# EAGLE design 0-30V Stabilized PSU Mk.10 (EAGLE 6.4)
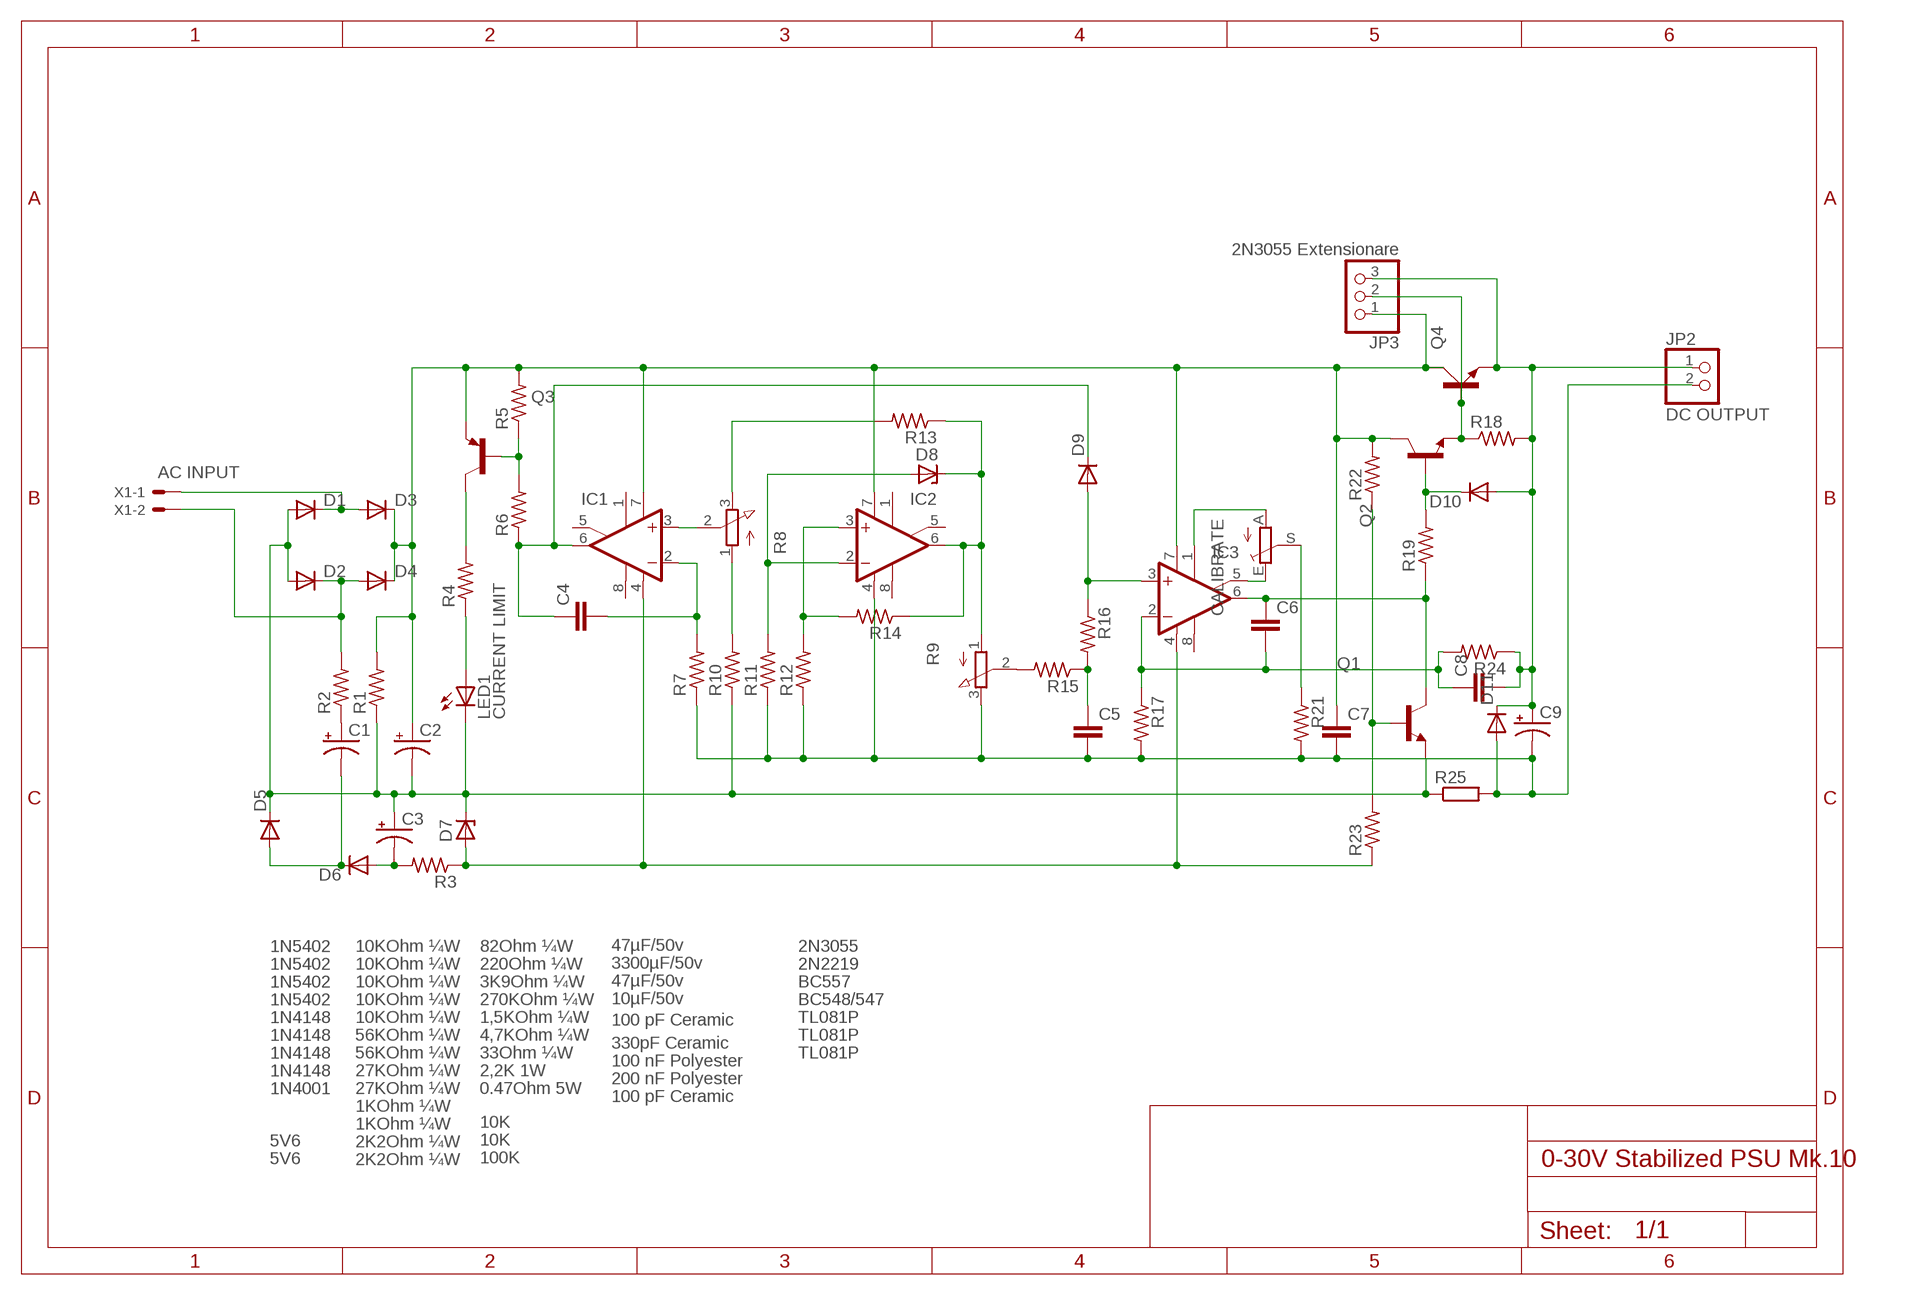
[diagram p0: schematic, sheet 1]

## Parts
C1  47µF/50v  CPOL-USTT2D4  [TT2D4]
C2  3300µF/50v  CPOL-USE10-20  [EB20D]
C3  47µF/50v  CPOL-USTT2D4  [TT2D4]
C4  330pF Ceramic  C-EU025-024X044  [C025-024X044]
C5  100 nF Polyester  C-EU050-025X075  [C050-025X075]
C6  100 pF Ceramic  C-EU050-024X044  [C050-024X044]
C7  200 nF Polyester  C-EU075-032X103  [C075-032X103]
C8  100 pF Ceramic  C-EU050-024X044  [C050-024X044]
C9  10µF/50v  CPOL-USE5-4  [E5-4]
CALIBRATE  100K  TRIM_EU-CA6V  [CA6V]
D1  1N5402  1N5400  [DO201-15]
D2  1N5402  1N5400  [DO201-15]
D3  1N5402  1N5400  [DO201-15]
D4  1N5402  1N5400  [DO201-15]
D5  1N4148  1N4148DO35-10  [DO35-10]
D6  1N4148  1N4148DO35-10  [DO35-10]
D7  5V6  ZENER-DIODEDO34-7  [DO34Z7]
D8  5V6  ZENER-DIODEDO34-7  [DO34Z7]
D9  1N4148  1N4148DO35-7  [DO35-7]
D10  1N4148  1N4148DO35-7  [DO35-7]
D11  1N4001  1N4148DO35-7  [DO35-7]
IC1  TL081P  [DIL08]
IC2  TL081P  [DIL08]
IC3  TL081P  [DIL08]
JP2  DC OUTPUT  PINHD-1X2  [1X02]
JP3  2N3055 Extensionare  PINHD-1X3  [1X03]
LED1  CURRENT LIMIT  LED3MM  [LED3MM]
Q1  BC548/547  BC548  [TO92-EBC]
Q2  2N2219  [TO5]
Q3  BC557  [TO92-EBC]
Q4  2N3055  [TO3A]
R1  2,2K 1W  R-US_0613/15  [P0613/15]
R2  82Ohm ¼W  R-US_0204/7  [0204/7]
R3  220Ohm ¼W  R-US_0204/7  [0204/7]
R4  3K9Ohm ¼W  R-US_0204/7  [0204/7]
R5  2K2Ohm ¼W  R-US_0204/7  [0204/7]
R6  10KOhm ¼W  R-US_0204/7  [0204/7]
R7  10KOhm ¼W  R-US_0204/7  [0204/7]
R8  10K  3RP/1610N  [3RP/1610N]
R9  10K  3RP/1610N  [3RP/1610N]
R10  33Ohm ¼W  R-US_0204/7  [0204/7]
R11  4,7KOhm ¼W  R-US_0204/7  [0204/7]
R12  10KOhm ¼W  R-US_0204/7  [0204/7]
R13  56KOhm ¼W  R-US_0204/7  [0204/7]
R14  10KOhm ¼W  R-US_0204/7  [0204/7]
R15  27KOhm ¼W  R-US_0204/7  [0204/7]
R16  2K2Ohm ¼W  R-US_0204/7  [0204/7]
R17  27KOhm ¼W  R-US_0204/7  [0204/7]
R18  1KOhm ¼W  R-US_0207/2V  [0207/2V]
R19  1KOhm ¼W  R-US_0207/2V  [0207/2V]
R21  270KOhm ¼W  R-US_0204/7  [0204/7]
R22  10KOhm ¼W  R-US_0204/7  [0204/7]
R23  1,5KOhm ¼W  R-US_0204/7  [0204/7]
R24  56KOhm ¼W  R-US_0204/7  [0204/7]
R25  0.47Ohm 5W  R-EU_VTA54  [VTA54]
X1  AC INPUT  22-23-2021  [22-23-2021]

## Nets
0-30VDC: C8.2 C9.+ D10.A D11.C JP2.1 JP3.3 Q4.E R18.2 R24.1
0VAC: D1.C D3.A X1.1
24VAC: D2.C D4.A R2.2 X1.2
GND: C5.2 C7.2 C9.- D11.A IC2.4(V-) JP2.2 R7.1 R9.3(E) R11.1 R12.1 R17.2 R21.2 R25.2
N$3: LED1.A R4.1
N$4: C1.- D5.A D6.C
N$6: C1.+ R2.1
N$7: Q3.C R4.2
N$8: Q3.B R5.1 R6.2
N$9: C3.- D6.A R3.2
N$10: D7.A IC1.4(V-) IC3.4(V-) R3.1 R23.1
N$11: C4.1 D9.C IC1.6(OUT) R6.1
N$12: C4.2 IC1.2(-IN) R7.2
N$13: IC1.3(+IN) R8.2(S)
N$14: R8.1(A) R10.2
N$15: C2.- C3.+ D1.A D2.A D5.C D7.C LED1.K(C) Q1.E R1.1 R10.1 R25.1
N$16: D8.C IC2.6(OUT) R9.1(A) R13.1 R14.1
N$17: IC2.3(+IN) R12.2 R14.2
N$18: D8.A IC2.2(-IN) R11.2
N$19: R8.3(E) R13.2
N$21: R9.2(S) R15.2
N$22: C5.1 R15.1 R16.2
N$23: D9.A IC3.3(+IN) R16.1
N$25: JP3.2 Q2.1(E) Q4.B R18.1
N$26: D10.C Q2.2(B) R19.2
N$27: C6.1 IC3.6(OUT) Q1.C R19.1
N$28: CALIBRATE.E IC3.5(ON2)
N$29: CALIBRATE.A IC3.1(ON1)
N$30: CALIBRATE.S R21.1
N$31: Q1.B R22.1 R23.2
N$33: C2.+ C7.1 D3.C D4.C IC1.7(V+) IC2.7(V+) IC3.7(V+) JP3.1 Q2.3(C) Q3.E Q4.C Q4.C1(C) R1.2 R5.2 R22.2
N$34: C6.2 C8.1 IC3.2(-IN) R17.1 R24.2
Unconnected: IC1.1(ON1) IC1.5(ON2) IC1.8(OPT) IC2.1(ON1) IC2.5(ON2) IC2.8(OPT) IC3.8(OPT)

## Library data of the parts
C1-C3 = rcl:CPOL-US: POLARIZED CAPACITOR, American symbol
C4-C8 = resistor:C-EU: CAPACITOR, European symbol
C9 = resistor:CPOL-US: POLARIZED CAPACITOR, American symbol
CALIBRATE = pot:TRIM_EU-: POTENTIOMETER
D1-D4 = diode:1N5400: DIODE standard rectifier, 3 A, 50 V (Motorola)
D5 D6 D9-D11 = diode:1N4148: DIODE high speed (Philips)
D7 D8 = diode:ZENER-DIODE: Z-Diode
IC1-IC3 = linear:TL081: OP AMP
JP2 = pinhead:PINHD-1X2: PIN HEADER
JP3 = pinhead:PINHD-1X3: PIN HEADER
LED1 = led:LED: LED OSRAM: - CHIPLED LG R971, LG N971, LY N971, LG Q971, LY Q971, LO R971, LY R971 LH N974, LH R974 LS Q976, LO Q976, LY Q976 LO Q996 - Hyper CHIPLED LW Q18S LB Q993, LB Q99A, LB R99A - SideLED LS A670, LO A670, LY A670, LG A670, LP A670 LB A673, LV A673, LT A673, LW A673 LH A674 LY A675 LS A676, LA A676, LO A676, LY A676, LW A676 LS A679, LY A679, LG A679 - Hyper Micro SIDELED® LS Y876, LA Y876, LO Y876, LY Y876 LT Y87S - SmartLED LW L88C, LW L88S LB L89C, LB L89S, LG L890 LS L89K, LO L89K, LY L89K LS L896, LA L896, LO L896, LY L896 - TOPLED LS T670, LO T670, LY T670, LG T670, LP T670 LSG T670, LSP T670, LSY T670, LOP T670, LYG T670 LG T671, LOG T671, LSG T671 LB T673, LV T673, LT T673, LW T673 LH T674 LS T676, LA T676, LO T676, LY T676, LB T676, LH T676, LSB T676, LW T676 LB T67C, LV T67C, LT T67C, LS T67K, LO T67K, LY T67K, LW E67C LS E67B, LA E67B, LO E67B, LY E67B, LB E67C, LV E67C, LT E67C LW T67C LS T679, LY T679, LG T679 LS T770, LO T770, LY T770, LG T770, LP T770 LB T773, LV T773, LT T773, LW T773 LH T774 LS E675, LA E675, LY E675, LS T675 LS T776, LA T776, LO T776, LY T776, LB T776 LHGB T686 LT T68C, LB T68C - Hyper Mini TOPLED® LB M676 - Mini TOPLED Santana® LG M470 LS M47K, LO M47K, LY M47K Source: http://www.osram.convergy.de LUXEON: - LUMILED® LXK2-PW12-R00, LXK2-PW12-S00, LXK2-PW14-U00, LXK2-PW14-V00 LXK2-PM12-R00, LXK2-PM12-S00, LXK2-PM14-U00 LXK2-PE12-Q00, LXK2-PE12-R00, LXK2-PE12-S00, LXK2-PE14-T00, LXK2-PE14-U00 LXK2-PB12-K00, LXK2-PB12-L00, LXK2-PB12-M00, LXK2-PB14-N00, LXK2-PB14-P00, LXK2-PB14-Q00 LXK2-PR12-L00, LXK2-PR12-M00, LXK2-PR14-Q00, LXK2-PR14-R00 LXK2-PD12-Q00, LXK2-PD12-R00, LXK2-PD12-S00 LXK2-PH12-R00, LXK2-PH12-S00 LXK2-PL12-P00, LXK2-PL12-Q00, LXK2-PL12-R00 Source: www.luxeon.com KINGBRIGHT: KA-3528ASYC Source: www.kingbright.com
Q1 = transistor-npn:BC548*: NPN Transistor
Q2 = transistor-npn:2N2219: NPN Transistor
Q3 = transistor-pnp:BC557*: PNP Transistror
Q4 = transistor-power:2N3055: NPN TRANSISTOR
R1 = resistor:R-US_: RESISTOR, American symbol
R2-R7 R10-R19 R21-R24 = rcl:R-US_: RESISTOR, American symbol
R8 R9 = pot:3RP/1610N: 16mm Potentiometer one level Source: http://www.alphapotentiometers.net/html/16mm_pot_2.html
R25 = rcl:R-EU_: RESISTOR, European symbol
X1 = con-molex:22-23-2021: .100" (2.54mm) Center Header - 2 Pin; MF: MOLEX; MPN: 22-23-2021; OC_FARNELL: 1462926; OC_NEWARK: 25C3832

## Board
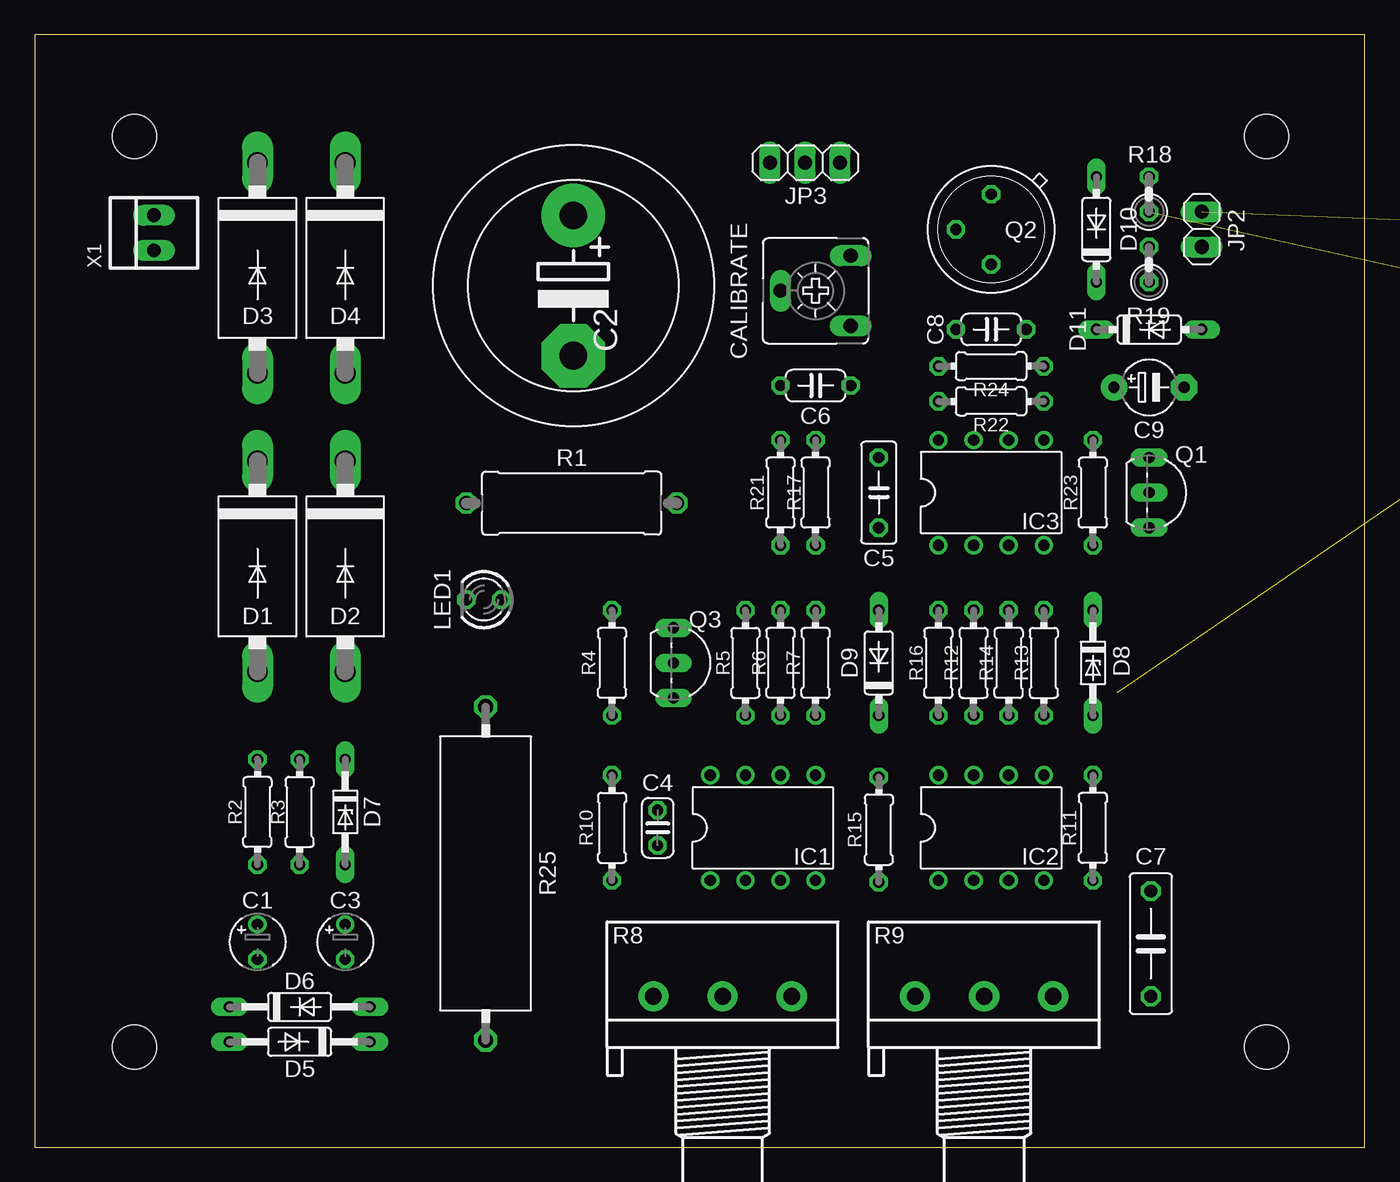
[diagram p1: board, top side]
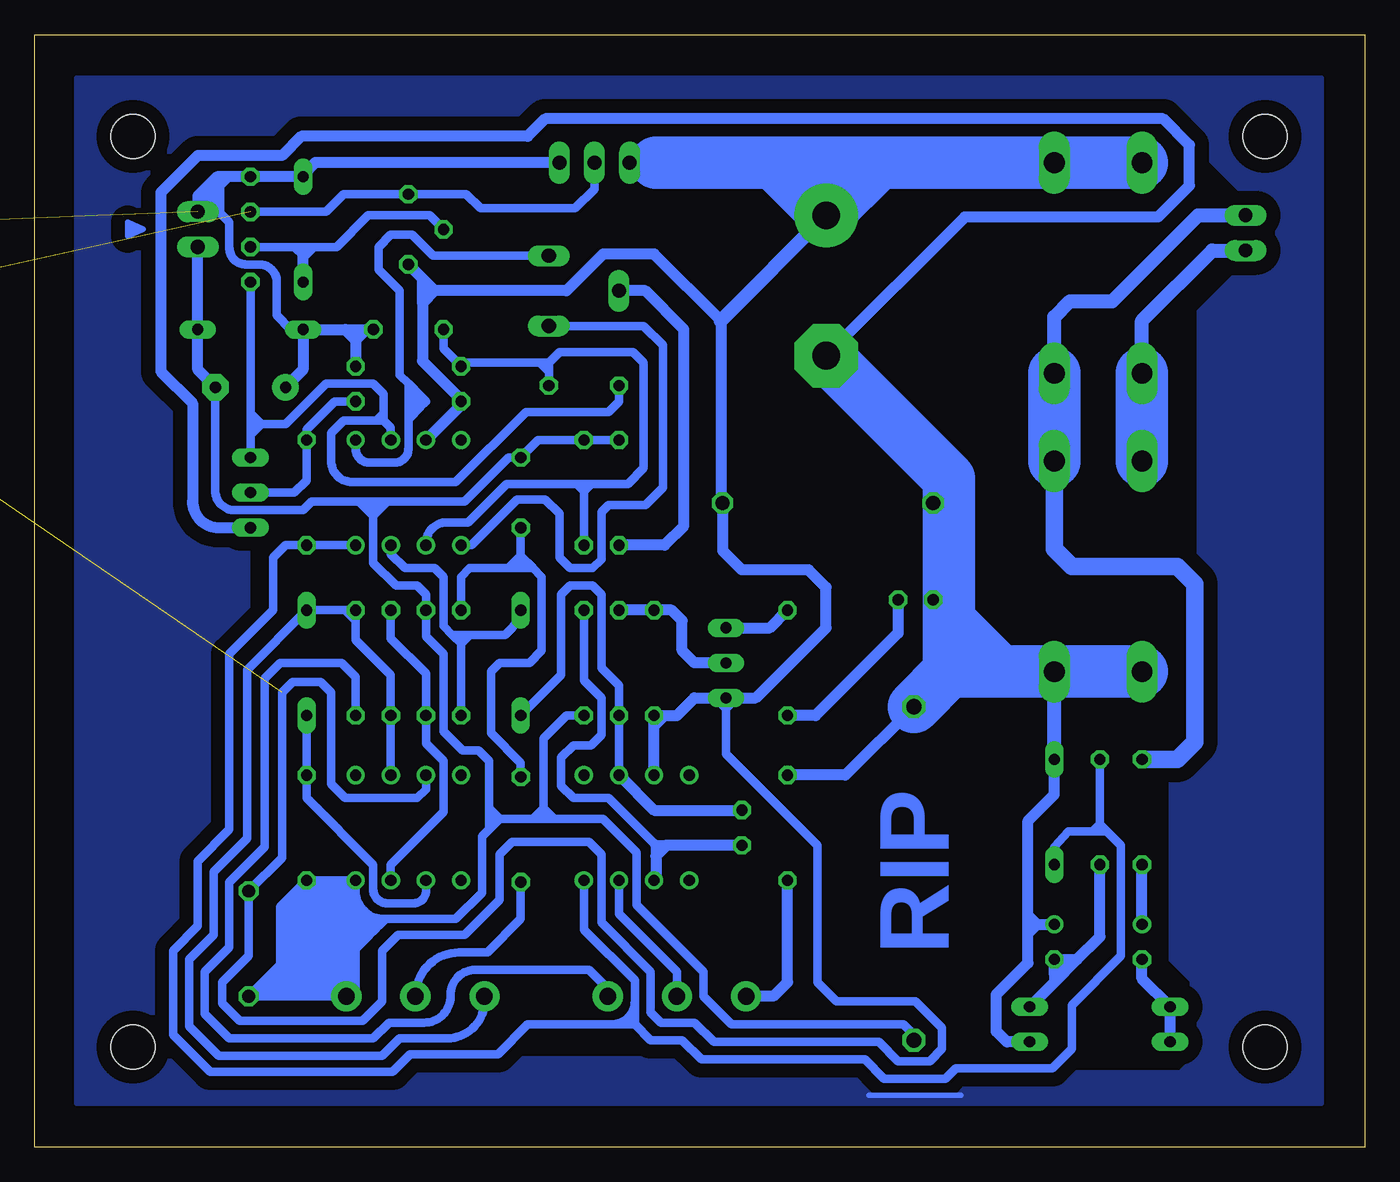
[diagram p2: board, bottom side, seen from below]

Size 96.27 x 80.52 mm. Coordinates in mm from the lower left corner, seen from the top.
Outline: 0,0 96.27,0 96.27,80.52 0,80.52 0,0
Copper layers (1*16): Top 0.035mm / dielectric 1.5mm / Bottom 0.035mm
Design rules "default": minimum track width 10mil, minimum drill 24mil, track to track 8mil, track to pad 8mil, pad to pad 8mil, via to via 8mil, smd to smd 8mil, copper to edge 40mil, drill to drill 8mil, minimum pad ring 10mil, minimum via ring 8mil, stop-mask expansion 4mil, vias tented up to drill 0mil, thermal gap 10mil
Holes 3.2 mm at 89.15,73.15 7.24,73.15 7.24,7.24 89.15,7.24

### Footprints (pad centres in the part's own frame; a part is rotated, then mirrored left to right if it is on the bottom)
TT2D4 = drill 0.813: + -1.27,0 | drill 0.813 octagon: - 1.27,0
EB20D = drill 2.007 pad 4.597: + -5.08,0 | drill 2.007 pad 4.597 octagon: - 5.08,0
C025-024X044 = drill 0.813 octagon: 1 -1.27,0; 2 1.27,0
C050-025X075 = drill 0.813 octagon: 1 -2.54,0; 2 2.54,0
C050-024X044 = drill 0.813 octagon: 1 -2.54,0; 2 2.54,0
C075-032X103 = drill 0.914 octagon: 1 -3.81,0; 2 3.81,0
E5-4 = drill 0.813 pad 1.905: + -2.54,0 | drill 0.813 pad 1.905 octagon: - 2.54,0
CA6V = drill 1.016 long: A -2.54,-2.54; E 2.54,-2.54; S 0,2.54
DO201-15 = drill 1.499 long: A 7.62,0; C -7.62,0
DO35-10 = drill 0.813 long: A 5.08,0; C -5.08,0
DO34Z7 = drill 0.813 long: A 3.81,0; C -3.81,0
DO35-7 = drill 0.813 long: A 3.81,0; C -3.81,0
DIL08 = drill 0.813 pad 1.27: 1 -3.81,-3.81; 2 -1.27,-3.81; 3 1.27,-3.81; 4 3.81,-3.81; 5 3.81,3.81; 6 1.27,3.81; 7 -1.27,3.81; 8 -3.81,3.81
1X02 = drill 1.016 long: 1 -1.27,0; 2 1.27,0
1X03 = drill 1.016 long: 1 -2.54,0; 2 0,0; 3 2.54,0
LED3MM = drill 0.813 octagon: A -1.27,0; K 1.27,0
TO92-EBC = drill 0.813 long: B 0,-1.27; C -2.54,-1.27; E 2.54,-1.27
TO5 = drill 0.813 octagon: 1 0,-2.54; 2 2.54,0; 3 0,2.54
TO3A = drill 1.194 pad 3.15 long: B -1.778,5.461; E -1.778,-5.461 | drill 4.115 pad 6.477: C 15.113,0; C1 -15.113,0
P0613/15 = drill 1.016 octagon: 1 -7.62,0; 2 7.62,0
0204/7 = drill 0.813 octagon: 1 -3.81,0; 2 3.81,0
3RP/1610N = drill 1.2 pad 2.184: 1 -5,0; 2 0,0; 3 5,0
0207/2V = drill 0.813 octagon: 1 -1.27,0; 2 1.27,0
VTA54 = drill 1.1 octagon: 1 -12.065,0; 2 12.065,0
22-23-2021 = drill 1 long: 1 -1.27,0; 2 1.27,0

### Placement (x,y rotation side)
C1  16.13,14.86 270 top
C2  38.99,62.36 270 top
C3  22.48,14.86 270 top
C4  45.09,23.11 270 top
C5  61.09,47.37 90 top
C6  56.52,55.12 0 top
C7  80.77,14.73 270 top
C8  69.22,59.18 0 top
C9  80.65,54.99 0 top
CALIBRATE  56.52,61.98 90 top
D1  16.13,42.04 270 top
D2  22.48,42.04 270 top
D3  16.13,63.63 270 top
D4  22.48,63.63 270 top
D5  19.18,7.62 180 top
D6  19.18,10.16 0 top
D7  22.48,24.26 270 top
D8  76.58,35.05 270 top
D9  61.09,35.05 90 top
D10  76.84,66.42 90 top
D11  80.65,59.18 0 top
IC1  52.7,23.11 0 top
IC2  69.22,23.11 0 top
IC3  69.22,47.37 0 top
JP2  84.46,66.42 270 top
JP3  55.75,71.25 0 top
LED1  32.51,39.62 180 top
Q1  81.92,47.37 270 top
Q2  69.22,66.42 180 top
Q3  47.5,35.05 270 top
Q4  115.19,61.47 225 top  (outside the outline)
R1  38.86,46.61 0 top
R2  16.13,24.26 90 top
R3  19.18,24.26 270 top
R4  41.78,35.05 90 top
R5  51.44,35.05 270 top
R6  53.98,35.05 90 top
R7  56.52,35.05 90 top
R8  49.78,10.92 0 top
R9  68.71,10.92 0 top
R10  41.78,23.11 270 top
R11  76.58,23.11 90 top
R12  67.95,35.05 270 top
R13  73.03,35.05 270 top
R14  70.48,35.05 90 top
R15  61.09,22.99 270 top
R16  65.41,35.05 90 top
R17  56.52,47.37 90 top
R18  80.65,68.96 90 top
R19  80.65,63.88 90 top
R21  53.98,47.37 90 top
R22  69.22,53.98 180 top
R23  76.58,47.37 90 top
R24  69.22,56.52 180 top
R25  32.64,19.81 270 top
X1  8.64,66.17 90 top

### Tracks (layer width: path | path; a pad name or v marks a point on that pad's centre or on a via)
0-30VDC  (1 unrouted)
  Bottom 0.61: D11.C 77.72,59.18 78.74,60.2 78.74,62.6 arc-90 80.02,63.88 81,63.88 arc90 82.17,65.05 82.17,66.93 82.93,67.69
  Bottom 0.813: D11.C 76.84,56.26 C9.+ | 72.26,59.18 C8.2 | D11.C 72.26,59.18 | 73.03,58.42 R24.1 | 72.26,59.18 73.03,58.42 | D11.C 73.79,59.18 73.03,58.42 | 83.69,67.69 JP2.1 84.46,68.83 83.69,69.6 | 82.3,70.23 82.93,70.23 | 83.69,69.6 83.06,70.23 82.93,70.23 | 82.93,70.23 82.93,69.6 | 82.93,69.6 82.93,67.69 83.69,67.69 | 83.69,67.69 83.69,69.6 | JP3.3 75.95,71.25 76.84,70.36 D10.A R18.2 82.3,70.23 | 82.3,70.23 82.93,69.6
0VAC
  Bottom 1.016: D3.A 16.13,59.82 11.05,64.9 X1.1
  Bottom 3.81: D1.C D3.A
24VAC
  Bottom 1.016: D4.A 22.48,60.07 21.34,61.21 18.29,61.21 12.07,67.44 X1.2
  Bottom 1.27: D2.C 22.48,43.31 21.21,42.04 13.59,42.04 12.32,40.77 12.32,29.34 13.59,28.07 R2.2
  Bottom 3.81: D2.C D4.A
GND
  Bottom 0.61: 73.91,10.92 R9.3 73.41,10.92 | 73.91,10.92 74.42,10.92 | 74.93,10.92 75.44,10.92 | 75.95,10.92 76.45,10.92 | 76.96,10.92 77.47,10.92 | 77.98,10.92 78.49,10.92 | 78.99,10.92 79.38,10.92 | 58.67,23.75 55.12,23.75 52.7,21.34 52.7,17.53 47.88,12.7 47.88,10.92 45.85,8.89 33.4,8.89 32.64,8.13 R25.2 | 59.44,23.75 60.2,23.75 | 73.03,18.54 IC2.4 | 73.03,18.54 73.79,19.3 | R21.2 R17.2 59.82,51.18 C5.2 61.98,49.91 65.15,46.74 70.74,46.74 | C9.- 83.19,47.5 arc-90 81.79,46.1 76.84,46.1 76.2,46.74 72.77,46.74 | 71.76,46.74 70.74,46.74 | 71.76,45.72 71.76,46.74 | 71.76,45.72 71.76,42.29 70.1,40.64 68.58,40.64 67.95,40.01 R12.1 67.95,36.96 66.68,35.69 66.68,30.1 65.28,28.7 64.14,28.7 63.37,27.94 63.37,24.51 | 71.76,45.72 72.77,46.74 | 71.76,46.74 72.77,46.74 | 71.76,45.72 70.74,46.74 | R7.1 57.78,31.24 59.44,29.59 59.44,23.75 | 60.2,23.75 59.44,24.51 58.67,23.75 | 58.67,23.75 59.44,23.75 | 70.87,16.51 65.79,16.51 63.88,18.41 63.88,22.48 63.37,22.99 | 72.01,15.37 73.03,14.35 | 73.03,18.54 arc-90 70.99,16.51 70.87,16.51 | 74.42,19.3 74.93,19.3 | 75.44,19.3 75.95,19.3 | 76.45,19.3 R11.1 76.96,18.92 | 60.2,23.75 62.61,23.75 | 63.37,24.51 63.37,23.75 | 62.61,23.75 63.37,24.51 | 63.37,23.75 62.61,23.75 | 62.61,23.75 63.37,22.99 | 63.37,23.75 63.37,22.99 | 77.47,18.41 77.98,17.91 | 77.98,17.91 78.49,17.4 78.49,13.21 | 78.49,13.21 78.99,12.7 | 78.99,12.7 79.38,12.32 | 79.38,12.32 C7.2 | C7.2 80.14,10.92 78.49,12.57 | 78.49,12.57 78.49,13.21 | 78.49,12.57 78.49,10.92 | 78.49,10.92 78.99,10.92 | 78.99,10.92 78.99,12.7 | 78.49,13.21 77.98,13.72 | 77.98,13.72 77.98,17.91 | 77.98,13.72 77.98,10.92 | 77.98,10.92 77.47,10.92 | 77.47,10.92 77.47,18.41
  Bottom 0.61: 77.47,18.41 76.96,18.92 | 76.96,18.92 76.96,10.92 | 76.96,10.92 76.45,10.92 | 76.45,10.92 76.45,19.3 | 76.45,19.3 75.95,19.3 | 75.95,19.3 75.95,10.92 | 75.95,10.92 75.44,10.92 | 75.44,10.92 75.44,19.3 | 75.44,19.3 74.93,19.3 | 74.93,19.3 74.93,10.92 | 74.93,10.92 74.42,10.92 | 74.42,10.92 74.42,18.54 | 74.42,19.3 73.91,19.3 | 73.79,19.3 73.91,19.3 | 73.91,19.3 73.91,13.46 | 73.03,14.35 73.03,15.37 | 73.03,15.37 IC2.4 | IC2.4 73.15,19.3 | 73.15,19.3 73.41,19.3 | 73.41,19.3 73.41,10.92 | 73.91,10.92 73.91,13.46 | 73.91,13.46 73.03,14.35 | 73.03,14.35 73.03,11.3 73.41,10.92 | 70.87,16.51 71.37,16 | 71.37,16 arc90 73.15,17.78 73.15,19.3 | 73.41,19.3 73.79,19.3 | 71.37,16 71.63,15.75 | 71.63,15.75 72.01,15.37 | 72.01,15.37 73.03,15.37 | C7.2 79.38,10.92 | 79.38,10.92 79.38,12.32 | 71.63,15.75 arc90 74.42,18.54 | 74.42,18.54 74.42,19.3
  Bottom 0.813: C9.- 84.46,56.26 D11.A JP2.2
N$1
  Bottom 0.406: 35.89,3.76 29.23,3.76
  pour Bottom (isolate 1.016): 3.17,77.34 93.22,77.34 93.22,3.17 3.17,3.17 3.17,76.71
N$3
  Bottom 0.813: LED1.A 33.78,37.21 39.75,31.24 R4.1
N$4
  Bottom 0.813: C1.- 16.13,12.19 D6.C D5.A
N$6
  Bottom 0.813: C1.+ R2.1
N$7
  Bottom 0.813: Q3.C 43.05,37.59 R4.2
N$8
  Bottom 0.813: R6.2 R5.1 50.16,38.86 49.4,38.1 49.4,35.94 48.51,35.05 Q3.B
N$9
  Bottom 0.813: 22.48,11.94 D6.A | 22.48,12.57 22.48,11.94 | 22.48,12.57 C3.- 21.46,13.59 | 22.48,11.94 20.83,13.59 | 20.83,13.59 19.18,15.24 R3.2 | 21.46,13.59 20.83,13.59 | 22.48,12.57 21.46,13.59
N$10
  Bottom 0.61: D7.A 22.48,21.72 21.46,22.86 19.68,22.86 | 52.83,8.89 51.69,7.75 49.4,7.75 48.01,6.35 36.2,6.35 34.8,4.95 30.35,4.95 29.59,5.71 22.61,5.71 21.21,7.11 21.21,10.29 17.65,13.84 17.65,21.84 18.67,22.86 | IC3.4 R23.1 78.11,43.56 78.99,42.67 78.99,38.86 82.17,35.69 82.17,22.99 84.46,20.7 84.46,16 86.23,14.22 86.23,8.13 83.57,5.46 70.36,5.46 69.09,6.73 62.74,6.73 60.58,8.89 54.48,8.89 | IC1.4 56.52,15.75 52.83,12.07 52.83,10.54 | 52.83,8.89 52.83,10.54 | 18.67,22.86 19.68,22.86 | 19.18,23.37 R3.1 | 18.67,22.86 19.18,23.37 | 19.68,22.86 19.18,23.37 | 52.83,8.89 54.48,8.89 | 54.48,8.89 arc-90 52.83,10.54
N$11
  Bottom 0.61: IC1.6 R6.1 53.98,33.4 55.24,34.67 55.24,40.01 55.88,40.64 57.53,40.64 58.17,40.01 58.17,34.16 D9.C
  Bottom 0.813: IC1.6 51.44,24.38 C4.1
N$12
  Bottom 0.61: R7.2 56.52,33.78 55.24,32.51 55.24,29.84 56.01,29.08 57.28,29.08 58.17,28.19 58.17,26.16 57.28,25.27 54.74,25.27 51.31,21.84
  Bottom 0.813: C4.2 50.55,21.84 | 51.31,21.08 51.31,21.84 50.55,21.84 | 51.31,21.08 51.31,19.43 IC1.2 | 50.55,21.84 51.31,21.08
N$13
  Bottom 0.61: IC1.3 53.98,16.89 49.78,12.7 R8.2
N$14
  Bottom 0.813: R10.2 41.78,11.94 42.8,10.92 R8.1
N$15
  Bottom 0.61: LED1.K 30.1,39.62
  Bottom 0.813: D5.C 25.91,7.62 26.67,8.38 26.67,11.05 24.38,13.34 24.38,15.49 | D7.C 22.48,25.53 24.38,23.62 24.38,16.76 | 24.38,15.49 24.38,16.76 | 23.75,16.13 C3.+ | 24.38,16.76 23.75,16.13 | 24.38,15.49 23.75,16.13 | Q1.E 82.93,44.83 arc90 84.84,46.74 84.84,53.85 87.12,56.13 87.12,69.09 84.46,71.76 78.36,71.76 76.96,73.15 60.58,73.15 59.31,74.42 14.61,74.42 12.7,72.52 12.7,69.6 14.99,67.31 28.96,67.31 C2.- | R1.1 30.1,46.61 | R25.1 37.59,26.92 R10.1
  Bottom 1.016: D7.C D2.A
  Bottom 1.27: D2.A 22.48,35.69
  Bottom 3.81: D1.A D2.A 26.42,34.42 | 30.1,34.42 R25.1 | 30.1,34.42 30.1,38.1 | 30.1,38.1 30.1,39.62 30.1,46.61 30.1,48.39 C2.- | 30.1,34.42 26.42,34.42 | 26.42,34.42 30.1,38.1
N$16
  Bottom 0.61: 73.79,38.86 R13.1 73.03,38.1 | 73.79,38.86 D8.C 80.9,34.54 80.9,22.35 83.31,19.94 83.31,15.37 85.09,13.59 85.09,8.76 82.93,6.6 71.12,6.6 69.85,7.87 66.42,7.87 arc-90 63.71,10.59 R9.1 | IC2.6 R14.1 70.48,34.16 73.03,36.7 73.03,38.1 | 73.79,38.86 73.03,38.1
N$17
  Bottom 0.61: R14.2 70.48,36.83 67.95,34.29 R12.2 67.95,29.21 66.68,27.94 66.68,24.26 70.48,20.45 IC2.3
N$18
  Bottom 0.61: IC2.2 67.95,18.54 arc90 68.83,17.65 70.74,17.65 arc90 71.76,18.67 71.76,20.45 76.58,25.27 R11.2 D8.A
N$19
  Bottom 0.61: R8.3 54.78,11.48 56.13,12.83 64.39,12.83 arc-90 66.17,11.05 66.17,10.92 arc90 68.07,9.02 70.61,9.02 71.76,7.87 82.17,7.87 83.95,9.65 83.95,12.7 82.17,14.48 82.17,19.18 79.63,21.72 79.63,33.91 78.49,35.05 74.04,35.05 73.03,34.04 R13.2
N$21
  Bottom 0.61: R15.2 61.09,16.51 63.5,14.1 65.53,14.1 arc-90 R9.2
N$22
  Bottom 0.61: R15.1 61.09,27.81 63.25,29.97 63.25,34.42 62.61,35.05 60.45,35.05 59.56,35.94 59.56,41.27 60.2,41.91 | R16.2 65.41,41.27 64.77,41.91 61.98,41.91 | 61.09,42.8 61.98,41.91 | 61.09,42.8 C5.1 | 60.2,41.91 61.09,42.8 | 60.2,41.91 61.09,41.91 | 61.09,41.91 61.98,41.91 | 61.09,42.8 61.09,41.91
N$23
  Bottom 0.61: 66.04,37.08 64.77,37.08 | 64.77,37.08 62.23,37.08 61.09,38.23 D9.A | 66.04,37.08 66.68,37.72 66.68,41.27 67.31,41.91 69.47,41.91 70.48,42.93 IC3.3 | R16.1 65.41,36.45 | 65.41,36.45 66.04,37.08 | 65.41,36.45 64.77,37.08
N$24
  cutout Bottom: 8.64,68.45 14.61,74.42 59.31,74.42 60.58,73.15 76.96,73.15 78.36,71.76 84.46,71.76 87.12,69.09 87.12,56.13 84.84,53.85 84.84,46.74 arc-90 82.93,44.83 80.52,44.83 80.52,37.08 82.17,35.43 82.17,22.99 84.46,20.7 84.46,16 86.23,14.22 86.23,8.13 83.57,5.46 70.36,5.46 69.09,6.73 48.39,6.73 48.01,6.35 36.2,6.35 35.56,5.71 13.46,5.71 12.83,6.35 12.83,11.94 14.35,13.46 14.35,27.3 12.32,29.34 12.32,60.58 8.64,64.26
N$25  (1 unrouted)
  Bottom 0.61: JP3.2 55.75,69.34 57.15,67.95 64.01,67.95 65.02,68.96 65.28,68.96 Q2.1 73.91,68.96 75.18,67.69 R18.1
N$26
  Bottom 0.61: 76.84,64.52 76.84,65.15 | 76.84,65.15 76.07,65.15 | 76.07,65.15 76.84,64.39 76.84,64.52 | 76.84,64.52 77.47,65.15 | 77.47,65.15 76.84,65.15 | Q2.2 67.69,67.44 72.14,67.44 74.42,65.15 76.07,65.15 | R19.2 77.47,65.15
  Bottom 0.813: D10.C 76.84,64.39
N$27
  Bottom 0.61: 80.65,53.09 R19.1 | 80.65,52.32 80.65,51.56 | 79.88,52.32 78.11,52.32 75.18,55.24 71.76,55.24 70.99,54.48 70.99,53.09 | 79.88,52.32 80.65,52.32 | 70.99,52.58 70.99,53.09 | 71.5,52.58 70.99,52.58 | 70.99,52.58 70.48,52.07 IC3.6 | 71.5,52.58 73.91,52.58 74.8,51.69 74.8,49.66 arc-90 73.28,48.13 65.79,48.13 60.71,53.21 54.74,53.21 53.98,53.98 C6.1 | 71.5,52.58 70.99,53.09 | 80.65,51.56 Q1.C | 79.88,52.32 80.65,51.56 | 79.88,52.32 80.65,53.09 | 80.65,52.32 80.65,53.09
N$28
  Bottom 0.61: 69.22,55.24 69.85,55.88 69.85,61.98 71.37,63.5 71.37,65.15 70.48,66.04 68.96,66.04 67.44,64.52 CALIBRATE.E | IC3.5 73.03,50.55 arc-90 72.01,49.53 70.23,49.53 arc-90 69.22,50.55 69.22,52.7 | 69.22,53.98 69.22,54.36 | 69.22,54.36 69.22,55.24 | 69.22,55.24 68.33,54.36 | 68.33,54.36 67.95,53.98 | 67.95,53.98 68.33,53.59 | 68.33,53.59 69.22,52.7 | 69.22,52.7 69.22,53.59 | 67.95,53.98 69.22,53.98 | 68.33,53.59 69.22,53.59 | 69.22,53.59 69.22,53.98 | 69.22,54.36 68.33,54.36
N$29
  Bottom 0.61: IC3.1 64.64,43.56 61.34,46.86 59.31,46.86 58.29,45.85 58.29,42.67 57.53,41.91 55.88,41.91 55.24,42.55 55.24,45.97 54.74,46.48 52.07,46.48 50.8,47.75 50.8,58.04 52.2,59.44 CALIBRATE.A
N$30
  Bottom 0.813: R21.1 50.67,43.56 49.28,44.96 49.28,59.18 52.07,61.98 CALIBRATE.S
N$31
  Bottom 0.61: Q1.B 77.47,47.37 76.58,48.26 R23.2 76.58,51.94 74.55,53.98 R22.1
N$32
  Bottom 0.406: 88.39,66.42 89.54,66.93 89.54,66.42 | 88.39,66.42 89.54,65.91 89.54,66.42 | 88.39,66.42 89.54,66.42
N$33  (2 unrouted)
  Bottom 0.61: IC2.7 67.95,25.91 68.58,25.27 73.79,25.27 74.8,26.29 74.8,32.89 75.57,33.66 77.6,33.66 78.36,32.89 78.36,20.95 C7.1 80.77,13.84 82.68,11.94 82.68,10.41 81.41,9.14 72.52,9.14 71.12,10.54 71.12,14.22 69.98,15.37 65.15,15.37 62.61,17.91 62.61,21.21 61.72,22.1 56.13,22.1 55.24,21.21 55.24,16.26 51.69,12.7 51.69,9.78 50.93,9.02 48.51,9.02 47.12,7.62 35.18,7.62 33.78,6.22 31.5,6.22 30.61,7.11 30.61,8.64 32.51,10.54 38.23,10.54 39.62,11.94 39.62,21.84 46.23,28.45 46.23,31.75 | 46.23,31.75 45.47,32.51 | 46.23,31.75 46.99,32.51
  Bottom 0.813: 50.67,31.24 R5.2 51.44,30.48 | 50.67,31.24 49.78,31.24 48.51,32.51 46.99,32.51 Q3.E 45.47,32.51 44.07,32.51 38.99,37.59 38.99,40.51 40.26,41.78 45.09,41.78 46.48,43.18 R1.2 46.61,46.61 46.61,59.82 51.44,64.64 55.12,64.64 57.78,61.98 67.31,61.98 | IC3.7 65.41,53.72 R22.2 65.41,54.1 68.2,56.9 68.2,61.09 | 51.31,71.25 JP3.1 | IC1.7 51.44,30.48 | 51.44,30.48 50.67,31.24 | 67.31,61.98 68.2,61.09 | Q2.3 68.2,62.87 | 68.2,62.87 67.31,61.98 | 68.2,61.09 68.2,62.87
  Bottom 1.016: 46.61,59.82 C2.+
  Bottom 3.81: D3.C D4.C 35.18,71.25 | 35.18,71.25 C2.+ 42.8,71.25 | 35.18,71.25 42.8,71.25 | 42.8,71.25 51.31,71.25
N$34
  Bottom 0.61: 59.05,56.77 58.29,57.53 52.96,57.53 52.2,56.77 52.2,49.15 53.34,48.01 56.01,48.01 | 59.05,56.77 59.05,56.13 | 59.05,56.13 C6.2 | C8.1 66.68,57.78 65.66,56.77 | 57.02,48.01 62.1,48.01 64.9,45.21 66.55,45.21 arc-90 IC3.2 | R17.1 56.52,47.5 | 59.05,56.77 59.69,56.77 | 59.69,56.77 65.66,56.77 | 59.69,56.77 59.05,56.13 | 65.66,56.77 R24.2 | 56.52,47.5 57.02,48.01 | 57.02,48.01 56.01,48.01 | 56.01,48.01 56.52,47.5

### Text on the board
Bottom: RIP